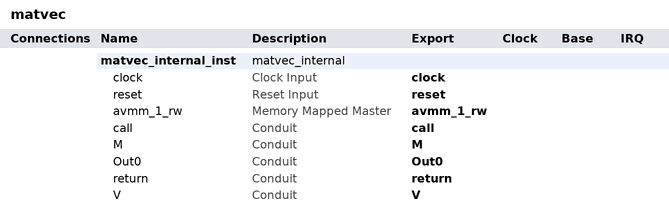
[diagram p0: system contents]
# Platform Designer (Qsys) system matvec, Cyclone V 5CSEMA4U23C7
# Parameters at their usual value, and those the tool derives, are not listed.
package require qsys
create_system matvec
set_project_property DEVICE_FAMILY {Cyclone V}
set_project_property DEVICE 5CSEMA4U23C7

add_instance matvec_internal_inst matvec_internal 1.0
set_instance_property matvec_internal_inst AUTO_EXPORT true

# exported interfaces
add_interface M conduit end
set_interface_property M EXPORT_OF matvec_internal_inst.M
add_interface Out0 conduit end
set_interface_property Out0 EXPORT_OF matvec_internal_inst.Out0
add_interface V conduit end
set_interface_property V EXPORT_OF matvec_internal_inst.V
add_interface avmm_1_rw avalon master
set_interface_property avmm_1_rw EXPORT_OF matvec_internal_inst.avmm_1_rw
add_interface call conduit end
set_interface_property call EXPORT_OF matvec_internal_inst.call
add_interface clock clock sink
set_interface_property clock EXPORT_OF matvec_internal_inst.clock
add_interface reset reset sink
set_interface_property reset EXPORT_OF matvec_internal_inst.reset
add_interface return conduit end
set_interface_property return EXPORT_OF matvec_internal_inst.return

set_interconnect_requirement {$system} qsys_mm.clockCrossingAdapter HANDSHAKE
set_interconnect_requirement {$system} qsys_mm.enableEccProtection FALSE
set_interconnect_requirement {$system} qsys_mm.insertDefaultSlave FALSE
set_interconnect_requirement {$system} qsys_mm.maxAdditionalLatency 1

save_system matvec.qsys
